# EAGLE schematic Headphone-Amplifier-ClassAB-alt3 (EAGLE 7.2.0)
4x4 - Three Transistor Headphone Amplifier - Class AB http://www.electronics-diy.com/4x4.php
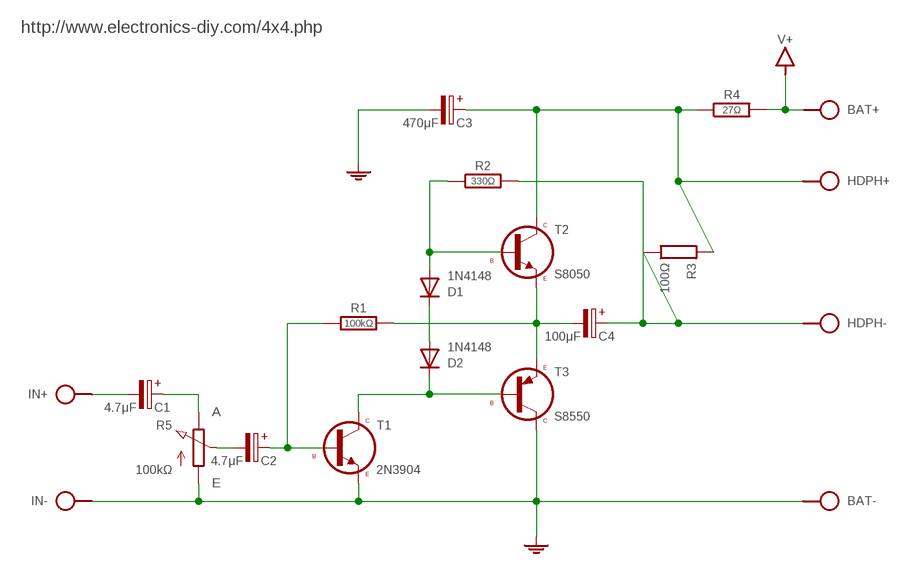
[diagram p0: schematic, sheet 1]

## Parts
BAT  SPAD+-+-  [SPAD+-]
C1  4.7μF  CPOL-HE2,5-3  [E2,5-3]
C2  4.7μF  CPOL-HE2,5-3  [E2,5-3]
C3  470μF  CPOL-HE2,5-5/V  [E2,5-5/V]
C4  100μF  CPOL-HE5-4  [E5-4]
D1  1N4148  DIODE34-5-V  [DO34-5-V]
D2  1N4148  DIODE34-5V  [DO34-5V]
HDPH  SPAD+--+  [SPAD-+]
IN  SPAD+--+  [SPAD-+]
R1  100kΩ  R-H0204/10  [0204/10]
R2  330Ω  R-H0204/10  [0204/10]
R3  100Ω  R0204/10  [0204/10]
R4  27Ω  R-H0204/10  [0204/10]
R5  100kΩ  POT-3P  [CONN-3P]
T1  2N3904  2N3904EBC  [TO92-EBC]
T2  S8050  S8050-TO92  [TO92-EBC]
T3  S8550  S8550-TO92  [TO92-EBC]

## Nets
GND: BAT.1 C3.- IN.1 R5.1(A) T1.E T3.C
N$1: D1.A R2.1 T2.B
N$2: D2.C T1.C T3.B
N$3: D1.C D2.A
N$4: C4.- R1.2 T2.E T3.E
N$5: C1.+ R5.3(E)
N$6: C2.- R5.2(S)
N$7: C2.+ R1.1 T1.B
N$8: C3.+ HDPH.2 R3.1 R4.1 T2.C
N$9: C4.+ HDPH.1 R2.2 R3.2
N$10: C1.- IN.2
V+: BAT.2 R4.2

## Notes on the sheet
- http://www.electronics-diy.com/4x4.php

## Library data of the parts
BAT HDPH IN = pad:SPAD+-
C1-C4 = c:CPOL-H
D1 D2 = d:DIODE
R1 R2 R4 = r:R-H
R3 = r:R: RESISTOR, European symbol
R5 = r:POT
T1 = t:2N3904
T2 = t:S8050
T3 = t:S8550

## Net classes
0 default: width 0.61 mm